# Altium schematic sheet power_supply.SchDoc: Power Circuitry
size A4; DrawnBy: Quentin Bouet; SheetNumber: 4; SheetTotal: 6
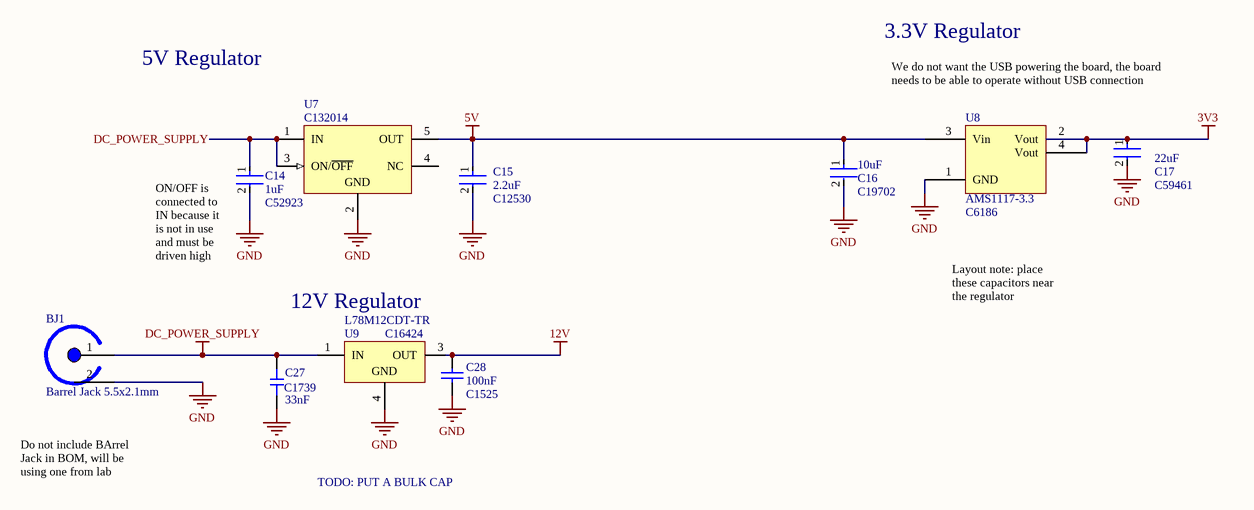
[diagram p0: power_supply.SchDoc]

## Parts
BJ1  Barrel Jack 5.5x2.1mm  [Barrel Jack 2.1x5.5mm THT]
C14  Capacitance: 1uF  JLCPCB Part: C52923  [FP-CL542-IPC_B]  (hidden comment: CL05A105KA5NQNC)
C15  Capacitance: 2.2uF  JLCPCB Part: C12530  [FP-CL50-IPC_C]  (hidden comment: CL05A225MQ5NSNC)
C16  JLCPCB Part: C19702  Capacitance: 10uF  [FP-CL10-IPC_B]  (hidden comment: CL10A106KP8NNNC)
C17  JLCPCB Part: C59461  Capacitance: 22uF  [FP-CL10-IPC_B]  (hidden comment: CL10A226MQ8NRNC)
C27  Capacitance: 33nF  JLCPCB Part: C1739  [CAP-0805]  (hidden comment: 0805B333K500NT)
C28  JLCPCB Part: C1525  Capacitance: 100nF  [CAPC1050X55X23NL05T13]  (hidden comment: CL05B104KO5NNNC)
U7  JLCPCB Part: C132014  [MF05A_M]  (hidden comment: LP2980AIM5-5.0/NOPB)
U8  AMS1117-3.3  JLCPCB Part: C6186  [SOT230P700X180-4N]
U9  L78M12CDT-TR  JLCPCB Part: C16424  [TO-252_L]

## Nets
3V3: C17.1 U8.2(Vout) U8.4(Vout)
5V: C15.1 C16.1 U7.5(OUT) U8.3(Vin)
12V: C28.2 U9.3(OUT)
DC_POWER_SUPPLY: BJ1.1(TIP) C14.1 C27.2 U7.1(IN) U7.3(ON/~{OFF}) U9.1(IN)
GND: BJ1.2(SLEEVE) C14.2 C15.2 C16.2 C17.2 C27.1 C28.1 U7.2(GND) U8.1(GND) U9.4(GND)

Not connected (* = marked no-connect by the designer): U7 4(NC)

## Notes on the sheet
- 5V Regulator
- 3.3V Regulator
- We do not want the USB powering the board, the board needs to be able to operate without USB connection
- (near C14) ON/OFF is connected to IN because it is not in use and must be driven high
- 12V Regulator
- Layout note: place these capacitors near the regulator
- Do not include BArrel Jack in BOM, will be using one from lab
- TODO: PUT A BULK CAP
- Date:
- Sheet
- of
- Time:
- Revision:
- Drawn by:
- File:

## Library data of the parts
BJ1 = CMP-005-0005-1: GCT DCJ200-10-A-K1-K; Pins: 2; Component Type: Standard; Design Item ID: Barrel Jack 5.5x2.1mm; Source: JCULibrary.SchLib; JLCPCB Part: jlcpcb part no.
C14 = CMP-00005-3: Cap Ceramic 1uF 25V X5R ±10% SMD 0402 +85°C Paper T/R; Height: 0.5mm; Thickness: 0.022inch; Radiation Hardening: No; Dielectric: X5R; Lead Free: Lead Free; Min Operating Temperature: -55°C; Mount: Surface Mount; Package Quantity: 10000; Case Code (Imperial): 0402; Voltage Rating: 25V; Case Code (Metric): 1005; Length: 1mm; Max Operating Temperature: 85°C; Case/Package: 0402; Tolerance: 10%; Packaging: Tape and Reel; Material: Ceramic; Depth: 0.5mm; Width: 0.02inch
C15 = CMP-13271-001039-1: Cap Ceramic 2.2uF 6.3V X5R ±20% SMD 0402 +85°C Paper T/R; Length: 1mm; Height: 0.5mm; Tolerance: 20%; Case/Package: 0402; Width: 0.02inch; Mount: Surface Mount; Case Code (Imperial): 0402; Case Code (Metric): 1005; Depth: 0.5mm; Lead Free: Lead Free; Package Quantity: 10000; Min Operating Temperature: -55°C; Max Operating Temperature: 85°C; Dielectric: X5R; Voltage Rating: 6.3V; Thickness: 0.022inch; Radiation Hardening: No; Packaging: Tape and Reel
C16 = CMP-00006-4: Cap Ceramic 10uF 10V X5R ±10% Pad SMD 0603 +85°C T/R; Case Code (Metric): 1608; Packaging: Tape and Reel; Case/Package: 0603; Voltage Rating: 10V; Mount: Surface Mount; Max Operating Temperature: 85°C; Width: 0.031inch; Length: 0.063inch; Case Code (Imperial): 0603; Thickness: 0.041inch; Tolerance: 10%; Min Operating Temperature: -55°C
C17 = CMP-006-0003-1: Cap Ceramic 22uF 6.3V X5R ±20% Pad SMD 0603; Thickness: 0.039inch; Length: 1.6mm; Case Code (Imperial): 0603; Voltage Rating: 6.3V; Mount: Surface Mount; Min Operating Temperature: -55°C; Case Code (Metric): 1608; Packaging: Tape and Reel; Max Operating Temperature: 85°C; Case/Package: 0603; Width: 0.031inch; Tolerance: 20%
C27 = CMP-001-00028-1: Capacitor, Ceramic (MLCC), 33nF, ±10%, 50V, X7R, ±10%, SMD 0805; Manufacturer: FH(Guangdong Fenghua Advanced Tech); ComponentLink2URL: https://jlcpcb.com/partdetail/C1739; Temperature Coefficient: X7R; Source: jlcpcb_capacitors_basic.schlib; ComponentLink3Description: LCSC Part URL; ComponentLink3URL: https://lcsc.com/product-detail/Multilayer-Ceramic-Capacitors-MLCC---SMD-SMT_FH-Guangdong-Fenghua-Advanced-Tech-FH-Guangdong-Fenghua-Advanced-Tech-0805B333K500NT_C1739.html; Tolerance: ±10%; RoHS: Yes; Package Size: 0805; Design Item ID: 0805B333K500NT; ComponentLink1Description: Datasheet; JLCPCB Basic Part: Yes; Manufacturer Part Number: 0805B333K500NT; Voltage Rating: 50V; ComponentLink1URL: https://datasheet.lcsc.com/lcsc/1811061723_FH--Guangdong-Fenghua-Advanced-Tech-0805B333K500NT_C1739.pdf; Category: Capacitors - MLCC; ComponentLink2Description: JLCPCB Part URL
C28 = CMP-00007-3: Chip Capacitor, 100 nF, +/- 10%, 16 V, -55 to 125 degC, 0402 (1005 Metric), RoHS, Tape and Reel; Manufacturer: Samsung Electro-Mechanics; Rated Voltage: 16V; Dielectric: X7R; Manufacturer URL: http://www.samsungsem.com/global/index.jsp; Datasheet Version: Nov-10; Case Size/Dimension: 0402; Tolerance (%): ±10%; Datasheet URL: https://datasheet.ciiva.com/29198/458718-da-01-en-vs-kondensator-0402-29198423.pdf
U7 = CMP-0062-02174-2: Micropower 50 mA Ultra Low-Dropout Regulator, 5-pin SOT-23, Pb-Free; Manufacturer: National Semiconductor; PackageTopMarking: L01A*XTT; CompType: LDO IC; PowerWise: N; PackageVersion: revD, Aug-2008; ComponentLink3URL: http://www.national.com/packaging/folders/mf05a.html; ComponentLink2Description: LP2980 Web Page; ComponentLink3Description: MF05A Package Page; PackageDescription: Molded SOT-23, .115 x .063 x .040 in Body, 5 Lead, .0375 in Pitch; DatasheetVersion: Sep-2006; ComponentLink1Description: LP2980 Datasheet; PackageReference: MF05A; ComponentLink2URL: http://www.national.com/pf/LP/LP2980.html; RoHS: Y; PinCount: 5; ComponentLink1URL: http://www.national.com/ds/LP/LP2980.pdf; RevisionNote: Component URLs added
U8 = CMP-00001-4: 3.3V 1A LOW DROPOUT VOLTAGE REGULATOR SOT-223; Dropout voltage: 1.3 V; Output current: 1 A; Output voltage: 3.3 V
U9 = CMP-0244-00204-1: Positive Voltage Regulator, 12V, 3-Pin DPAK, Tape and Reel; PackageDescription: 3-Pin Transistor Outline Package 2.28 mm Pitch, 9.7 mm Lead Span (DPAK); PackageVersion: 2011; PackageReference: TO-252; ComponentLink2URL: http://www.st.com/internet/com/TECHNICAL_RESOURCES/TECHNICAL_LITERATURE/DATASHEET/CD00000447.pdf; ComponentLink2Description: Datasheet; ComponentLink1URL: http://www.st.com; ComponentLink1Description: Manufacturer URL; DatasheetVersion: 1/11/2010